# EAGLE design W603B (EAGLE 6.6.0)
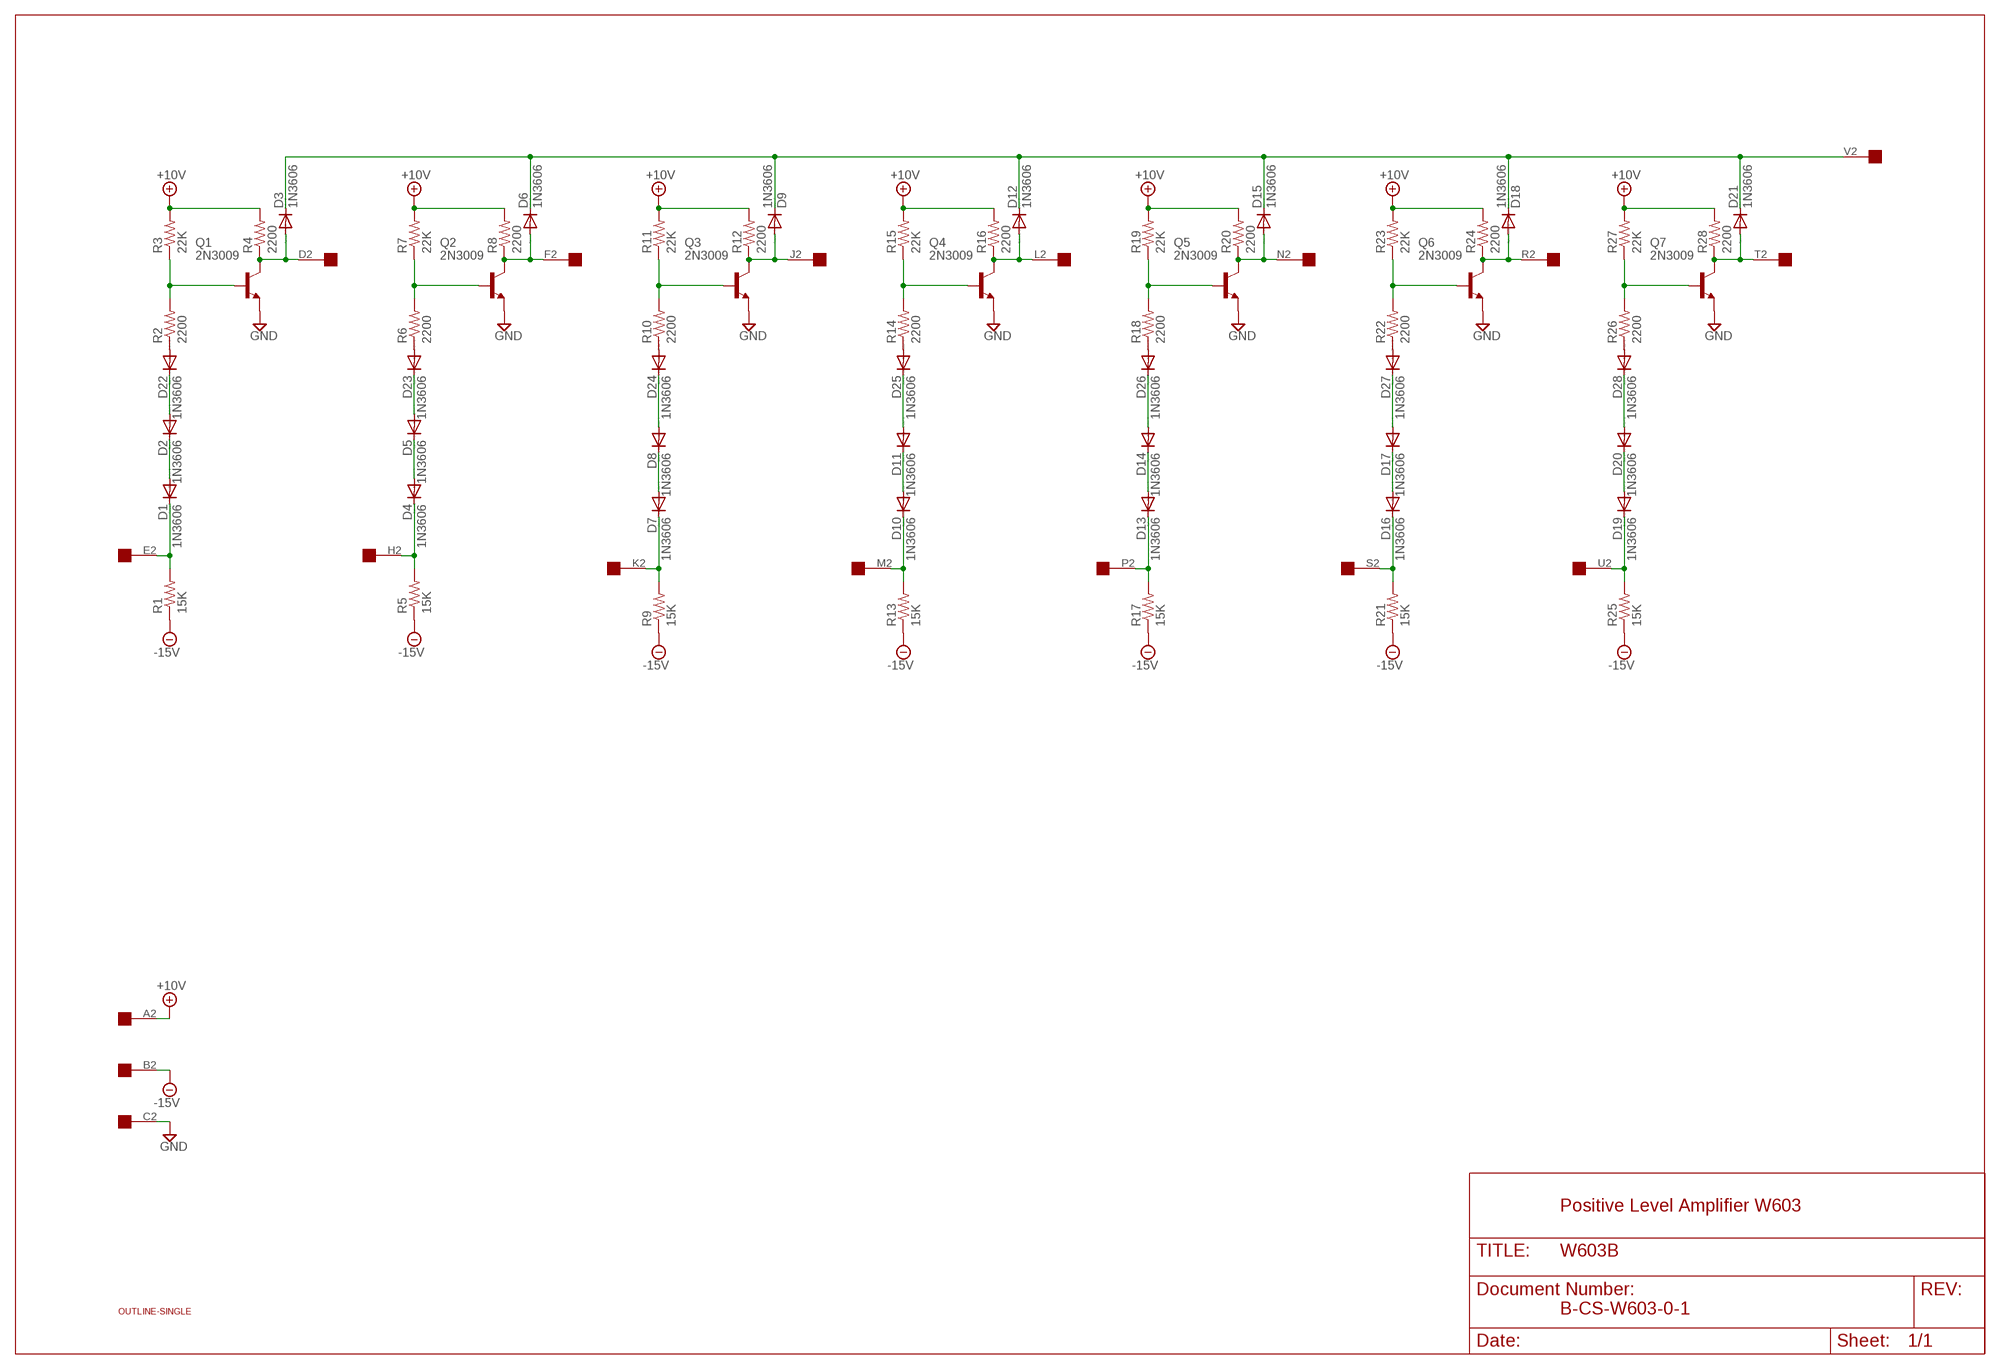
[diagram p0: schematic, sheet 1]

## Parts
D1  1N3606  1N4148DO35-10  [DO35-10]
D2  1N3606  1N4148DO35-10  [DO35-10]
D3  1N3606  1N4148DO35-10  [DO35-10]
D4  1N3606  1N4148DO35-10  [DO35-10]
D5  1N3606  1N4148DO35-10  [DO35-10]
D6  1N3606  1N4148DO35-10  [DO35-10]
D7  1N3606  1N4148DO35-10  [DO35-10]
D8  1N3606  1N4148DO35-10  [DO35-10]
D9  1N3606  1N4148DO35-10  [DO35-10]
D10  1N3606  1N4148DO35-10  [DO35-10]
D11  1N3606  1N4148DO35-10  [DO35-10]
D12  1N3606  1N4148DO35-10  [DO35-10]
D13  1N3606  1N4148DO35-10  [DO35-10]
D14  1N3606  1N4148DO35-10  [DO35-10]
D15  1N3606  1N4148DO35-10  [DO35-10]
D16  1N3606  1N4148DO35-10  [DO35-10]
D17  1N3606  1N4148DO35-10  [DO35-10]
D18  1N3606  1N4148DO35-10  [DO35-10]
D19  1N3606  1N4148DO35-10  [DO35-10]
D20  1N3606  1N4148DO35-10  [DO35-10]
D21  1N3606  1N4148DO35-10  [DO35-10]
D22  1N3606  1N4148DO35-10  [DO35-10]
D23  1N3606  1N4148DO35-10  [DO35-10]
D24  1N3606  1N4148DO35-10  [DO35-10]
D25  1N3606  1N4148DO35-10  [DO35-10]
D26  1N3606  1N4148DO35-10  [DO35-10]
D27  1N3606  1N4148DO35-10  [DO35-10]
D28  1N3606  1N4148DO35-10  [DO35-10]
Q1  2N3009  2N2102  [TO5]
Q2  2N3009  2N2102  [TO5]
Q3  2N3009  2N2102  [TO5]
Q4  2N3009  2N2102  [TO5]
Q5  2N3009  2N2102  [TO5]
Q6  2N3009  2N2102  [TO5]
Q7  2N3009  2N2102  [TO5]
R1  15K  R-US_0207/10  [0207/10]
R2  2200  R-US_0207/10  [0207/10]
R3  22K  R-US_0207/10  [0207/10]
R4  2200  R-US_0207/10  [0207/10]
R5  15K  R-US_0207/10  [0207/10]
R6  2200  R-US_0207/10  [0207/10]
R7  22K  R-US_0207/10  [0207/10]
R8  2200  R-US_0207/10  [0207/10]
R9  15K  R-US_0207/10  [0207/10]
R10  2200  R-US_0207/10  [0207/10]
R11  22K  R-US_0207/10  [0207/10]
R12  2200  R-US_0207/10  [0207/10]
R13  15K  R-US_0207/10  [0207/10]
R14  2200  R-US_0207/10  [0207/10]
R15  22K  R-US_0207/10  [0207/10]
R16  2200  R-US_0207/10  [0207/10]
R17  15K  R-US_0207/10  [0207/10]
R18  2200  R-US_0207/10  [0207/10]
R19  22K  R-US_0207/10  [0207/10]
R20  2200  R-US_0207/10  [0207/10]
R21  15K  R-US_0207/10  [0207/10]
R22  2200  R-US_0207/10  [0207/10]
R23  22K  R-US_0207/10  [0207/10]
R24  2200  R-US_0207/10  [0207/10]
R25  15K  R-US_0207/10  [0207/10]
R26  2200  R-US_0207/10  [0207/10]
R27  22K  R-US_0207/10  [0207/10]
R28  2200  R-US_0207/10  [0207/10]
U$1  OUTLINE-SINGLE  [SINGLE]
U$2  EDGE-1  [EDGE-CON1]

## Nets
+10V: R3.2 R4.2 R7.2 R8.2 R11.2 R12.2 R15.2 R16.2 R19.2 R20.2 R23.2 R24.2 R27.2 R28.2 U$2.A2
-15V: R1.1 R5.1 R9.1 R13.1 R17.1 R21.1 R25.1 U$2.B2
GND: Q1.1(E) Q2.1(E) Q3.1(E) Q4.1(E) Q5.1(E) Q6.1(E) Q7.1(E) U$2.C2
N$1: D1.C R1.2 U$2.E2
N$2: D22.A R2.1
N$3: D1.A D2.C
N$4: D2.A D22.C
N$5: Q1.2(B) R2.2 R3.1
N$6: D3.A Q1.3(C) R4.1 U$2.D2
N$7: D4.C R5.2 U$2.H2
N$8: D23.A R6.1
N$9: D4.A D5.C
N$10: D5.A D23.C
N$11: Q2.2(B) R6.2 R7.1
N$12: D6.A Q2.3(C) R8.1 U$2.F2
N$13: D7.C R9.2 U$2.K2
N$14: D24.A R10.1
N$15: D7.A D8.C
N$16: D8.A D24.C
N$17: Q3.2(B) R10.2 R11.1
N$18: D9.A Q3.3(C) R12.1 U$2.J2
N$19: D3.C D6.C D9.C D12.C D15.C D18.C D21.C U$2.V2
N$20: D10.C R13.2 U$2.M2
N$21: D25.A R14.1
N$22: D10.A D11.C
N$23: D11.A D25.C
N$24: Q4.2(B) R14.2 R15.1
N$25: D12.A Q4.3(C) R16.1 U$2.L2
N$26: D13.C R17.2 U$2.P2
N$27: D13.A D14.C
N$28: D14.A D26.C
N$29: Q5.2(B) R18.2 R19.1
N$30: D15.A Q5.3(C) R20.1 U$2.N2
N$31: D26.A R18.1
N$32: D16.C R21.2 U$2.S2
N$33: D27.A R22.1
N$34: D16.A D17.C
N$35: D17.A D27.C
N$36: Q6.2(B) R22.2 R23.1
N$37: D18.A Q6.3(C) R24.1 U$2.R2
N$38: D19.C R25.2 U$2.U2
N$39: D28.A R26.1
N$40: D19.A D20.C
N$41: D20.A D28.C
N$42: Q7.2(B) R26.2 R27.1
N$43: D21.A Q7.3(C) R28.1 U$2.T2

## Notes on the sheet
- Positive Level Amplifier W603
- B-CS-W603-0-1

## Library data of the parts
D1-D28 = diode:1N4148: DIODE high speed (Philips)
Q1-Q7 = transistor:2N2102: NPN TRANSISTOR
R1-R28 = rcl:R-US_: RESISTOR, American symbol
U$1 = dec-con:OUTLINE-*: Board outlines for DEC boards.
U$2 = dec-con:EDGE-1: Single-Sided DEC Edge Connector -- (side 2)

## Board
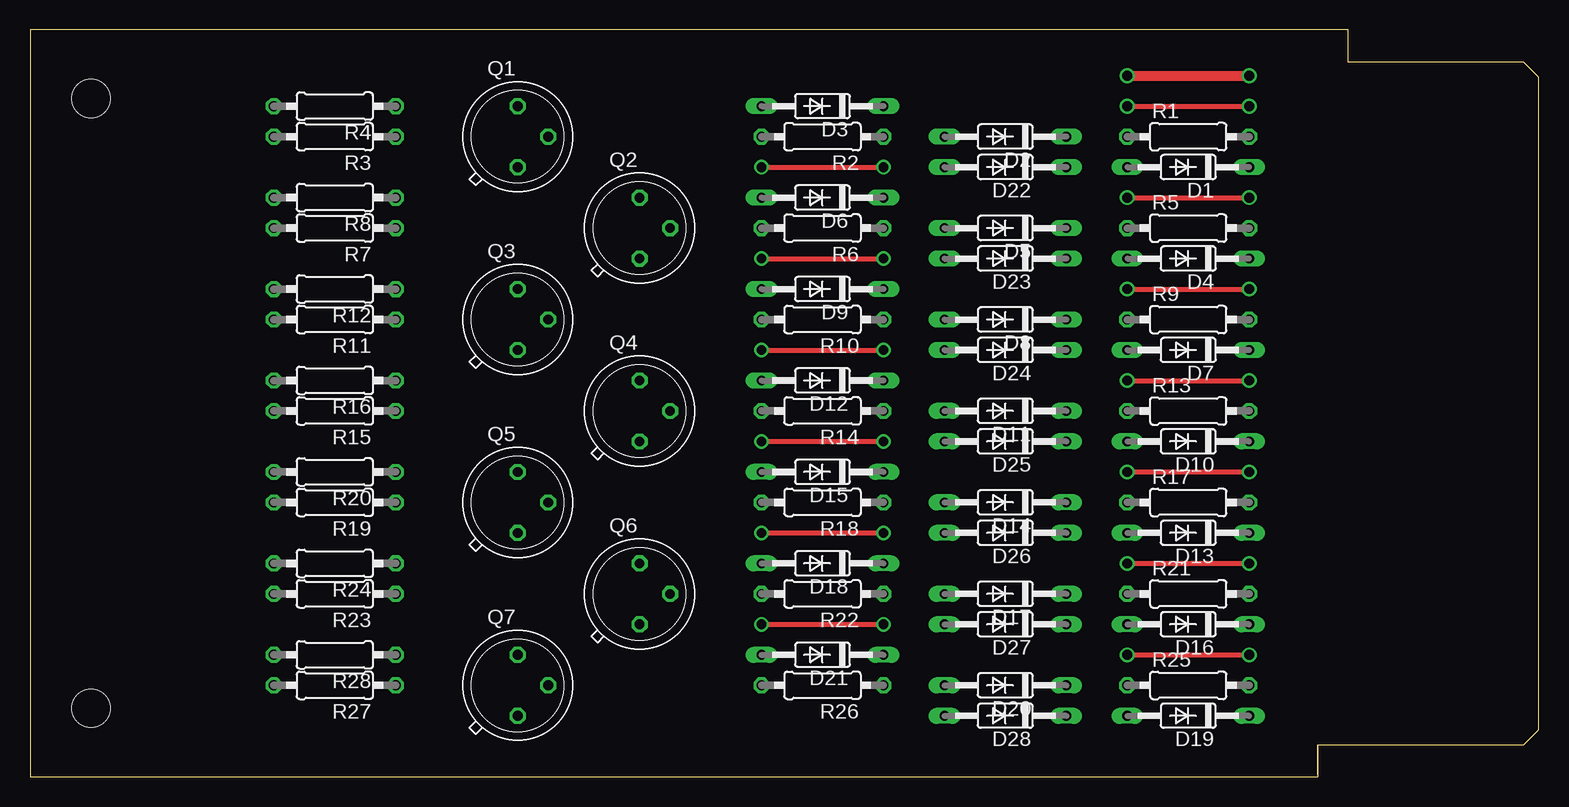
[diagram p1: board, top side]
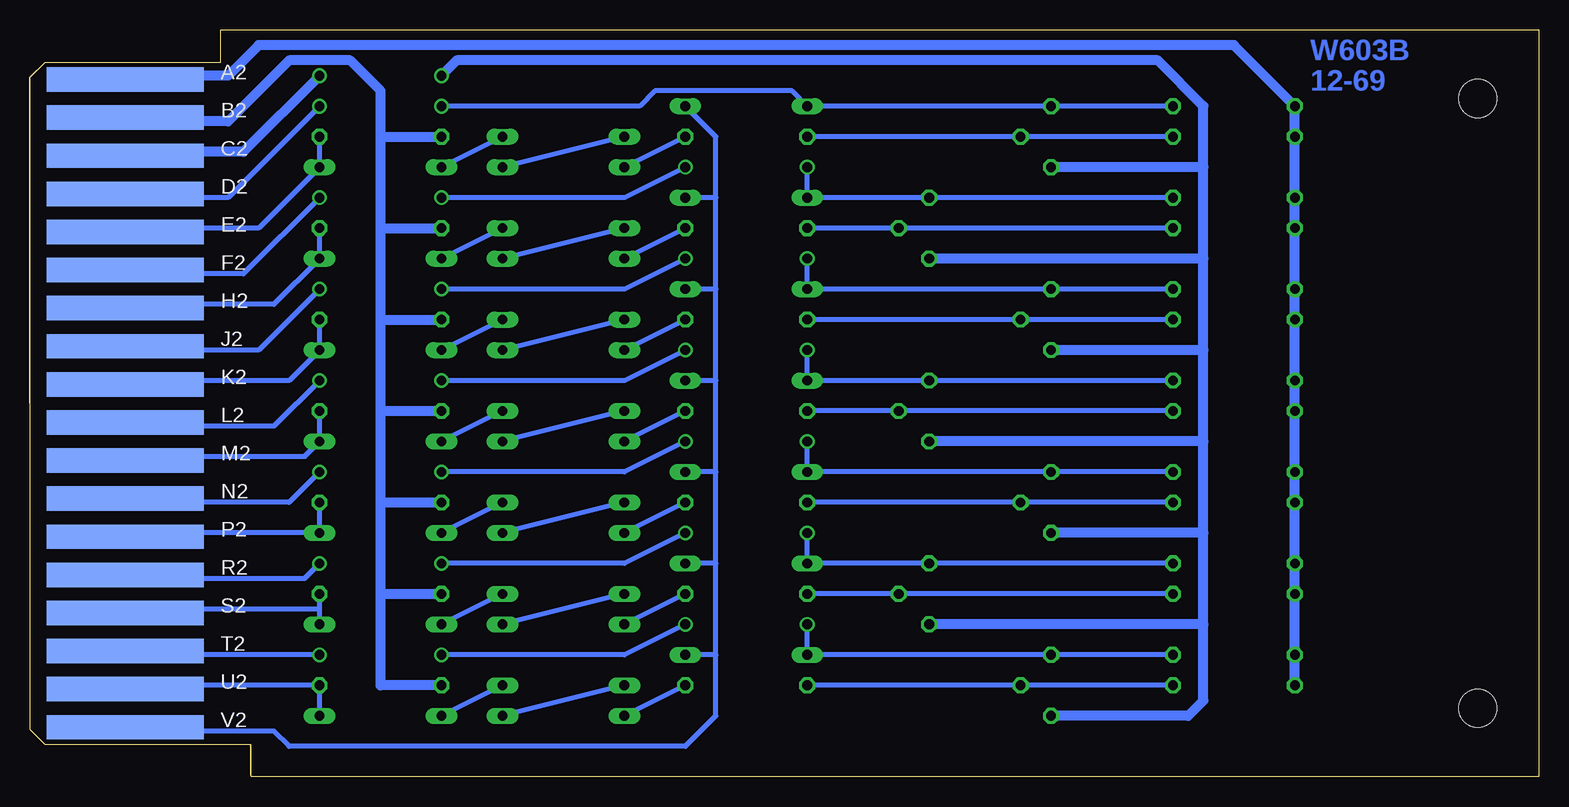
[diagram p2: board, bottom side, seen from below]

Size 125.73 x 62.23 mm. Coordinates in mm from the lower left corner, seen from the top.
Copper layers (1+16): Top 0.035mm / dielectric 1.5mm / Bottom 0.035mm
Design rules "16mils": minimum track width 16mil, minimum drill 32mil, track to track 15mil, track to pad 10mil, pad to pad 10mil, via to via 10mil, smd to smd 10mil, copper to edge 13mil, drill to drill 10mil, minimum pad ring 10mil, minimum via ring 8mil, stop-mask expansion 0mil, vias tented up to drill 0mil, thermal gap 10mil

### Footprints (pad centres in the part's own frame; a part is rotated, then mirrored left to right if it is on the bottom)
DO35-10 = drill 0.813 long: A 5.08,0; C -5.08,0
TO5 = drill 0.813 octagon: 1 0,-2.54; 2 2.54,0; 3 0,2.54
0207/10 = drill 0.813 octagon: 1 -5.08,0; 2 5.08,0
SINGLE = hole 3.175: 120.65,56.515; 120.65,5.715
EDGE-CON1 = smd 13.106 x 2.032 bottom: A2 7.938,4.128; B2 7.938,7.303; C2 7.938,10.477; D2 7.938,13.652; E2 7.938,16.828; F2 7.938,20.003; H2 7.938,23.177; J2 7.938,26.352; K2 7.938,29.527; L2 7.938,32.703; M2 7.938,35.877; N2 7.938,39.053; P2 7.938,42.227; R2 7.938,45.403; S2 7.938,48.578; T2 7.938,51.752; U2 7.938,54.928; V2 7.938,58.102

### Placement (x,y rotation side)
D1  96.52,50.8 180 top
D2  81.28,53.34 180 top
D3  66.04,55.88 180 top
D4  96.52,43.18 180 top
D5  81.28,45.72 180 top
D6  66.04,48.26 180 top
D7  96.52,35.56 180 top
D8  81.28,38.1 180 top
D9  66.04,40.64 180 top
D10  96.52,27.94 180 top
D11  81.28,30.48 180 top
D12  66.04,33.02 180 top
D13  96.52,20.32 180 top
D14  81.28,22.86 180 top
D15  66.04,25.4 180 top
D16  96.52,12.7 180 top
D17  81.28,15.24 180 top
D18  66.04,17.78 180 top
D19  96.52,5.08 180 top
D20  81.28,7.62 180 top
D21  66.04,10.16 180 top
D22  81.28,50.8 180 top
D23  81.28,43.18 180 top
D24  81.28,35.56 180 top
D25  81.28,27.94 180 top
D26  81.28,20.32 180 top
D27  81.28,12.7 180 top
D28  81.28,5.08 180 top
Q1  40.64,53.34 0 top
Q2  50.8,45.72 0 top
Q3  40.64,38.1 0 top
Q4  50.8,30.48 0 top
Q5  40.64,22.86 0 top
Q6  50.8,15.24 0 top
Q7  40.64,7.62 0 top
R1  96.52,53.34 0 top
R2  66.04,53.34 180 top
R3  25.4,53.34 180 top
R4  25.4,55.88 180 top
R5  96.52,45.72 0 top
R6  66.04,45.72 180 top
R7  25.4,45.72 180 top
R8  25.4,48.26 180 top
R9  96.52,38.1 0 top
R10  66.04,38.1 180 top
R11  25.4,38.1 180 top
R12  25.4,40.64 180 top
R13  96.52,30.48 0 top
R14  66.04,30.48 180 top
R15  25.4,30.48 180 top
R16  25.4,33.02 180 top
R17  96.52,22.86 0 top
R18  66.04,22.86 180 top
R19  25.4,22.86 180 top
R20  25.4,25.4 180 top
R21  96.52,15.24 0 top
R22  66.04,15.24 180 top
R23  25.4,15.24 180 top
R24  25.4,17.78 180 top
R25  96.52,7.62 0 top
R26  66.04,7.62 180 top
R27  25.4,7.62 180 top
R28  25.4,10.16 180 top
U$1  125.73,62.23 180 top
U$2  125.73,62.23 180 top

### Tracks (layer width: path | path; a pad name or v marks a point on that pad's centre or on a via)
+10V
  Bottom 0.813: U$2.A2 116.84,58.04 116.84,58.42 109.22,58.42 106.68,60.96 25.4,60.96 R4.2 R3.2 R8.2 R7.2 R12.2 R11.2 R16.2 R15.2 R20.2 R19.2 R24.2 R23.2 R28.2 R27.2
-15V
  Bottom 0.813: U$2.B2 117.13,54.9 116.84,54.61 109.22,54.61 104.14,59.69 99.06,59.69 96.52,57.15 96.52,53.34 | 96.52,15.24 96.52,7.62 R25.1 | 96.52,15.24 96.52,22.86 | 96.52,22.86 96.52,30.48 | 96.52,30.48 96.52,38.1 | 96.52,38.1 96.52,45.72 | 96.52,45.72 96.52,53.34 | 96.52,15.24 R21.1 | 96.52,22.86 R17.1 | 96.52,30.48 R13.1 | 96.52,38.1 R9.1 | 96.52,45.72 R5.1 | 96.52,53.34 R1.1
GND  (via drill 0.81, 0.81 pad 0.81)
  Top 0.813: v91.44,58.42 v101.6,58.42
  Bottom 0.813: U$2.C2 117.17,51.74 116.84,52.07 107.95,52.07 v101.6,58.42 | v91.44,58.42 90.17,59.69 31.75,59.69 27.94,55.88 27.94,50.8 | 27.94,12.7 27.94,6.35 29.21,5.08 Q7.1 | 27.94,12.7 27.94,20.32 | 27.94,20.32 27.94,27.94 | 27.94,27.94 27.94,35.56 | 27.94,35.56 27.94,43.18 | 27.94,43.18 27.94,50.8 | 27.94,12.7 Q6.1 | 27.94,20.32 Q5.1 | 27.94,27.94 Q4.1 | 27.94,35.56 Q3.1 | 27.94,43.18 Q2.1 | 27.94,50.8 Q1.1
N$1
  Bottom 0.406: U$2.E2 116.84,45.72 106.68,45.72 D1.C R1.2
N$2
  Bottom 0.406: R2.1 D22.A
N$3
  Bottom 0.406: D2.C D1.A
N$4
  Bottom 0.406: D2.A D22.C
N$5
  Bottom 0.406: R2.2 Q1.2 R3.1
N$6  (via drill 0.81 pad 0.81)
  Top 0.406: v91.44,55.88 v101.6,55.88
  Bottom 0.406: U$2.D2 117.14,48.56 116.84,48.26 109.22,48.26 v101.6,55.88 | v91.44,55.88 74.93,55.88 73.66,57.15 62.23,57.15 D3.A Q1.3 R4.1
N$7
  Bottom 0.406: U$2.H2 116.84,39.37 105.41,39.37 D4.C R5.2
N$8
  Bottom 0.406: R6.1 D23.A
N$9
  Bottom 0.406: D5.C D4.A
N$10
  Bottom 0.406: D5.A D23.C
N$11
  Bottom 0.406: R7.1 Q2.2 R6.2
N$12  (via drill 0.81 pad 0.81)
  Top 0.406: v60.96,50.8 v71.12,50.8 | v91.44,48.26 v101.6,48.26
  Bottom 0.406: R8.1 Q2.3 D6.A v60.96,50.8 | U$2.F2 117.12,42.19 116.84,41.91 107.95,41.91 v101.6,48.26 | v91.44,48.26 76.2,48.26 v71.12,50.8
N$13
  Bottom 0.406: U$2.K2 116.84,33.02 104.14,33.02 D7.C R9.2
N$14
  Bottom 0.406: R10.1 D24.A
N$15
  Bottom 0.406: D8.C D7.A
N$16
  Bottom 0.406: D8.A D24.C
N$17
  Bottom 0.406: R10.2 Q3.2 R11.1
N$18  (via drill 0.81 pad 0.81)
  Top 0.406: v60.96,43.18 v71.12,43.18 | v91.44,40.64 v101.6,40.64
  Bottom 0.406: R12.1 Q3.3 D9.A v60.96,43.18 | U$2.J2 117.17,35.89 116.84,35.56 106.68,35.56 v101.6,40.64 | v91.44,40.64 76.2,40.64 v71.12,43.18
N$19
  Bottom 0.406: D3.C 68.58,53.34 68.58,48.26 | 68.58,10.16 68.58,5.08 71.12,2.54 104.14,2.54 105.41,3.81 116.84,3.81 117.16,4.13 U$2.V2 | 68.58,10.16 68.58,17.78 | 68.58,17.78 68.58,25.4 | 68.58,25.4 68.58,33.02 | 68.58,33.02 68.58,40.64 | 68.58,40.64 68.58,48.26 | 68.58,17.78 D18.C | 68.58,25.4 D15.C | 68.58,33.02 D12.C | 68.58,40.64 D9.C | 68.58,48.26 D6.C | 68.58,10.16 D21.C
N$20
  Bottom 0.406: U$2.M2 116.84,26.67 102.87,26.67 D10.C R13.2
N$21
  Bottom 0.406: R14.1 D25.A
N$22
  Bottom 0.406: D11.C D10.A
N$23
  Bottom 0.406: D11.A D25.C
N$24
  Bottom 0.406: R15.1 Q4.2 R14.2
N$25  (via drill 0.81 pad 0.81)
  Top 0.406: v60.96,35.56 v71.12,35.56 | v91.44,33.02 v101.6,33.02
  Bottom 0.406: R16.1 Q4.3 D12.A v60.96,35.56 | U$2.L2 117.17,29.54 116.84,29.21 105.41,29.21 v101.6,33.02 | v91.44,33.02 76.2,33.02 v71.12,35.56
N$26
  Bottom 0.406: U$2.P2 116.84,20.32 D13.C R17.2
N$27
  Bottom 0.406: D14.C D13.A
N$28
  Bottom 0.406: D14.A D26.C
N$29
  Bottom 0.406: R19.1 Q5.2 R18.2
N$30  (via drill 0.81 pad 0.81)
  Top 0.406: v60.96,27.94 v71.12,27.94 | v91.44,25.4 v101.6,25.4
  Bottom 0.406: R20.1 Q5.3 D15.A v60.96,27.94 | U$2.N2 117.17,23.19 116.84,22.86 104.14,22.86 v101.6,25.4 | v91.44,25.4 76.2,25.4 v71.12,27.94
N$31
  Bottom 0.406: R18.1 D26.A
N$32
  Bottom 0.406: U$2.S2 116.84,13.97 101.6,13.97 | D16.C 101.6,13.97 | 101.6,13.97 R21.2
N$33
  Bottom 0.406: R22.1 D27.A
N$34
  Bottom 0.406: D17.C D16.A
N$35
  Bottom 0.406: D17.A D27.C
N$36
  Bottom 0.406: R23.1 Q6.2 R22.2
N$37  (via drill 0.81 pad 0.81)
  Top 0.406: v60.96,20.32 v71.12,20.32 | v91.44,17.78 v101.6,17.78
  Bottom 0.406: v60.96,20.32 D18.A Q6.3 R24.1 | U$2.R2 116.84,16.51 102.87,16.51 v101.6,17.78 | v91.44,17.78 76.2,17.78 v71.12,20.32
N$38
  Bottom 0.406: U$2.U2 116.84,7.62 R25.2 D19.C
N$39
  Bottom 0.406: R26.1 D28.A
N$40
  Bottom 0.406: D20.C D19.A
N$41
  Bottom 0.406: D20.A D28.C
N$42
  Bottom 0.406: R27.1 Q7.2 R26.2
N$43  (via drill 0.81 pad 0.81)
  Top 0.406: v60.96,12.7 v71.12,12.7 | v91.44,10.16 v101.6,10.16
  Bottom 0.406: R28.1 Q7.3 D21.A v60.96,12.7 | v71.12,12.7 76.2,10.16 v91.44,10.16 | U$2.T2 117.17,10.49 116.84,10.16 v101.6,10.16

### Text on the board
Bottom: W603B | 12-69